# Altium project 节能组取电V2.PrjPCB
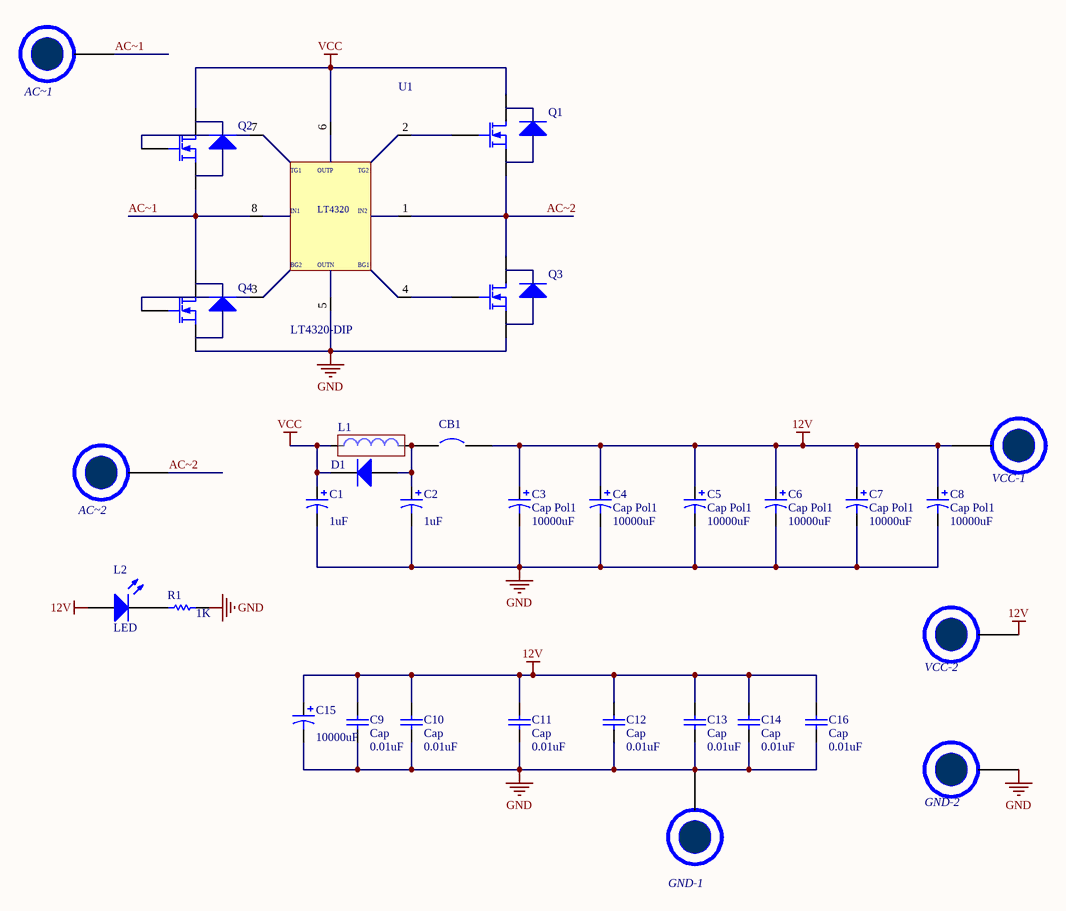
[diagram p0: 节能组取电V2.SchDoc]
1 sheet, 32 parts. Net scope: global (net labels, ports and power ports of the same name join across sheets).
Board file: 节能组取电V2.PcbDoc

## Sheet 节能组取电V2.SchDoc
size A4

### Parts
AC~1  PIN  [PIN]  (value not drawn)
AC~2  PIN  [PIN]  (value not drawn)
C1  value 1uF  [C2012]  (hidden comment: Cap Pol1)
C2  value 1uF  [C2012]  (hidden comment: Cap Pol1)
C3  Cap Pol1  value 10000uF  [RB7.6-15]
C4  Cap Pol1  value 10000uF  [RB7.6-15]
C5  Cap Pol1  value 10000uF  [RB7.6-15]
C6  Cap Pol1  value 10000uF  [RB7.6-15]
C7  Cap Pol1  value 10000uF  [RB7.6-15]
C8  Cap Pol1  value 10000uF  [RB7.6-15]
C9  Cap  value 0.01uF  [C2012]
C10  Cap  value 0.01uF  [C2012]
C11  Cap  value 0.01uF  [C2012]
C12  Cap  value 0.01uF  [C2012]
C13  Cap  value 0.01uF  [C2012]
C14  Cap  value 0.01uF  [C2012]
C15  value 10000uF  [RB7.6-15]  (hidden comment: Cap Pol1)
C16  Cap  value 0.01uF  [C2012]
CB1  Circuit Breaker  [SPST-2]  (value not drawn)
D1  Diode 1N4001  [SK54]  (value not drawn)
GND-1  PIN  [PIN]  (value not drawn)
GND-2  PIN  [PIN]  (value not drawn)
L1  33uH  [SMD-EC-F16]  (value not drawn)
L2  LED  [C2012]
Q1  MOSFET-N  [mos]  (value not drawn)
Q2  MOSFET-N  [mos]  (value not drawn)
Q3  MOSFET-N  [mos]  (value not drawn)
Q4  MOSFET-N  [mos]  (value not drawn)
R1  value 1K  [R2012]  (hidden comment: Res)
U1  LT4320-DIP  [DIP-8]
VCC-1  PIN  [PIN]  (value not drawn)
VCC-2  PIN  [PIN]  (value not drawn)

### Nets
12V: C3.1 C4.1 C5.1 C6.1 C7.1 C8.1 C9.2 C10.2 C11.2 C12.2 C13.2 C14.2 C15.1 C16.2 CB1.2 L2.1(A) VCC-1.1(PIN) VCC-2.1(PIN)
GND: C1.2 C2.2 C3.2 C4.2 C5.2 C6.2 C7.2 C8.2 C9.1 C10.1 C11.1 C12.1 C13.1 C14.1 C15.2 C16.1 GND-1.1(PIN) GND-2.1(PIN) Q3.3(S) Q4.3(S) R1.2 U1.5
VCC: C1.1 D1.2(K) L1.1 Q1.2(D) Q2.2(D) U1.6
AC~1: AC~1.1(PIN) Q2.3(S) Q4.2(D) U1.8
AC~2: AC~2.1(PIN) Q1.3(S) Q3.2(D) U1.1
NetC2_1: C2.1 CB1.1 D1.1(A) L1.2
NetL2_2: L2.2(K) R1.1
NetQ1_1: Q1.1(G) U1.2
NetQ2_1: Q2.1(G) U1.7
NetQ3_1: Q3.1(G) U1.4
NetQ4_1: Q4.1(G) U1.3

### Notes on the sheet
- (in symbol LT4320-DIP) TG1; OUTP; TG2; IN1; LT4320; IN2; BG2; OUTN; BG1

### Library data of the parts
C1-C8 C15 = Cap Pol1: Polarized Capacitor (Radial); Published: 8-Jun-2000; LatestRevisionDate: 17-Jul-2002; LatestRevisionNote: Re-released for DXP Platform.; PackageReference: RB7.6-15; Publisher: Altium Limited; PackageDescription: Polarized Capacitor (Radial); 2 Leads
C9-C14 C16 = Cap: Capacitor; Published: 8-Jun-2000; LatestRevisionDate: 17-Jul-2002; LatestRevisionNote: Re-released for DXP Platform.; PackageReference: RAD-0.3; Publisher: Altium Limited; PackageDescription: Radial Cap, Thru-Hole; 2 Leads; 0.3 in Pin Spacing
D1 = Diode 1N4001: 1 Amp General Purpose Rectifier; Published: 8-Jun-2000; LatestRevisionDate: 17-Jul-2002; LatestRevisionNote: Re-released for DXP Platform.; DatasheetVersion: 1998; PackageVersion: Aug-1999; PackageReference: DO-41; Publisher: Altium Limited; PackageDescription: Diode, Axial; Body 5.2 x 2.7 mm (LxDia. max), Lead Dia. 0.86 mm (max); Code_JEDEC: DO-204-AL; ComponentLink1Description: Manufacturer Link; ComponentLink1URL: http://www.fairchildsemi.com/; ComponentLink2Description: Datasheet; ComponentLink2URL: http://www.fairchildsemi.com/ds/1N%2F1N4001.pdf
L1 = Inductor
Q1-Q4 = MOSFET-N: N-Channel MOSFET; PackageDocument: 1995/1996; Published: 8-Jun-2000; LatestRevisionDate: 17-Jul-2002; LatestRevisionNote: Re-released for DXP Platform.; PackageReference: E3; Publisher: Altium Limited
R1 = Res: 贴片电阻; Published: 8-Jun-2000; LatestRevisionDate: 17-Jul-2002; LatestRevisionNote: Re-released for DXP Platform.; PackageReference: AXIAL-0.3; Publisher: Altium Limited
CB1 = Circuit Breaker: Published: 24-Mar-1999; LatestRevisionDate: 17-Jul-2002; LatestRevisionNote: Re-released for DXP Platform.; PackageReference: SPST-2; Publisher: Altium Limited; PackageDescription: Switch; 2 Leads